# EAGLE design LTC2473CDR1 (EAGLE 9.6.2)
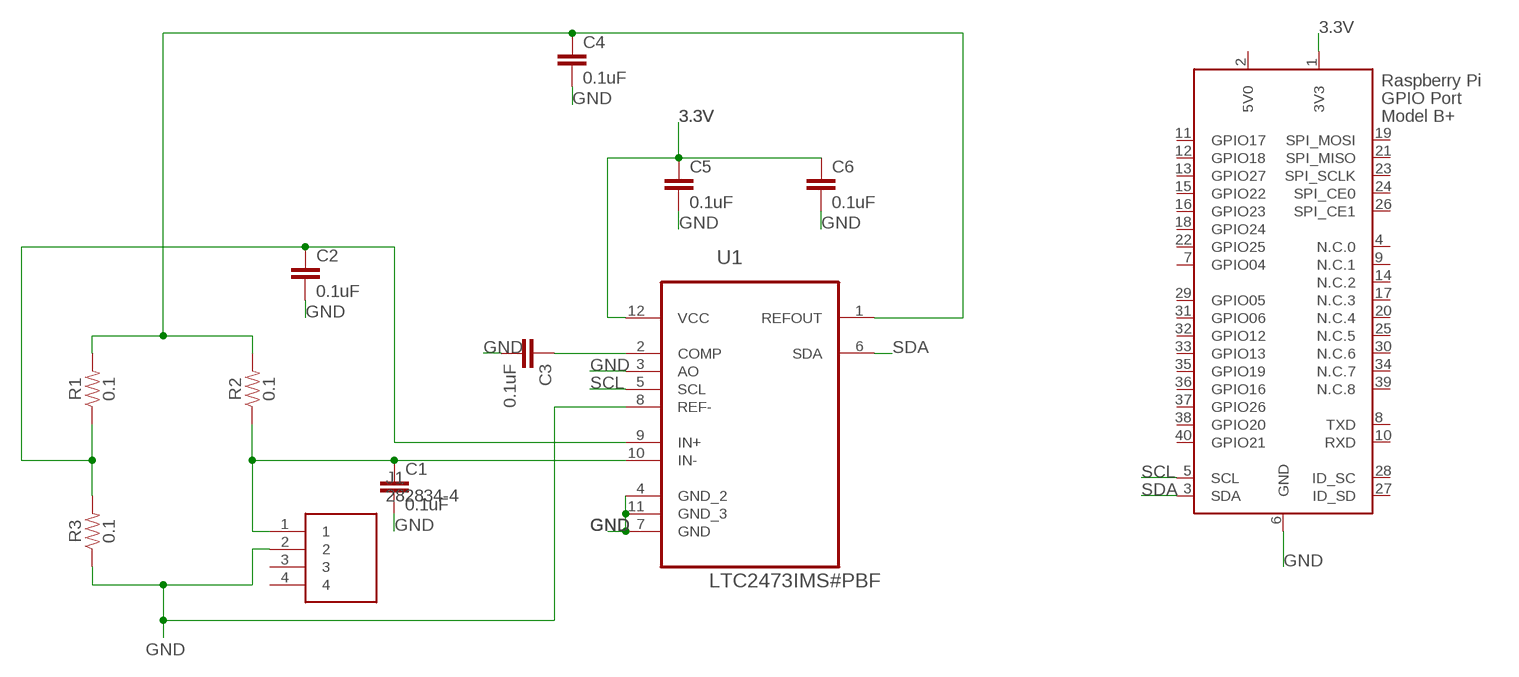
[diagram p0: schematic, sheet 1]

## Parts
C1  0.1uF  0.1UF-0603-25V-(+80/-20%)  [0603]
C2  0.1uF  0.1UF-0603-25V-(+80/-20%)  [0603]
C3  0.1uF  0.1UF-0603-25V-(+80/-20%)  [0603]
C4  0.1uF  0.1UF-0603-25V-(+80/-20%)  [0603]
C5  0.1uF  0.1UF-0603-25V-(+80/-20%)  [0603]
C6  0.1uF  0.1UF-0603-25V-(+80/-20%)  [0603]
J1  282834-4  [2828344]
R1  0.1  0.1OHM-0603-1/3W-1%  [0603]
R2  0.1  0.1OHM-0603-1/3W-1%  [0603]
R3  0.1  0.1OHM-0603-1/3W-1%  [0603]
U1  LTC2473IMS#PBF  [SOP65P490X110-12N]
X1  RASPI_BOARD_B+_HDC  [RASPI_BOARD_B+HAT_DF_CF]

## Nets
3.3V: C5.1 C6.1 U1.12(VCC) X1.1(3V3)
GND: C1.2 C2.2 C3.2 C4.2 C5.2 C6.2 J1.2 R3.1 U1.3(AO) U1.4(GND_2) U1.7(GND) U1.8(REF-) U1.11(GND_3) X1.6(GND)
N$1: C3.1 U1.2(COMP)
N$2: C2.1 R1.1 R3.2 U1.9(IN+)
N$4: C4.1 R1.2 R2.2 U1.1(REFOUT)
N$5: C1.1 J1.1 R2.1 U1.10(IN-)
SCL: U1.5(SCL) X1.5(SCL)
SDA: U1.6(SDA) X1.3(SDA)
Unconnected: J1.3 J1.4 X1.4(N.C.0) X1.7(GPIO04) X1.8(TXD) X1.9(N.C.1) X1.10(RXD) X1.11(GPIO17) X1.12(GPIO18) X1.13(GPIO27) X1.14(N.C.2) X1.15(GPIO22) X1.16(GPIO23) X1.17(N.C.3) X1.18(GPIO24) X1.19(SPI_MOSI) X1.20(N.C.4) X1.21(SPI_MISO) X1.22(GPIO25) X1.23(SPI_SCLK) X1.24(SPI_CE0) X1.25(N.C.5) X1.26(SPI_CE1) X1.27(ID_SD) X1.28(ID_SC) X1.29(GPIO05) X1.30(N.C.6) X1.31(GPIO06) X1.32(GPIO12) X1.33(GPIO13) X1.34(N.C.7) X1.35(GPIO19) X1.36(GPIO16) X1.37(GPIO26) X1.38(GPIO20) X1.39(N.C.8) X1.40(GPIO21)

## Power pins joined to a net without a drawn wire
5V0: X1.2(5V0)

## Library data of the parts
C1-C6 = SparkFun-Capacitors:0.1UF: 0.1µF ceramic capacitors A capacitor is a passive two-terminal electrical component used to store electrical energy temporarily in an electric field.; PROD_ID: CAP-00810
J1 = SamacSys_Parts:282834-4: ic Source: Datasheet <https://www.te.com/commerce/DocumentDelivery/DDEController?Action=srchrtrv&DocNm=282834&DocType=Customer Drawing&DocLang=English&PartCntxt=282834-4&DocFormat=pdf>; DESCRIPTION: ic; HEIGHT: 10.3mm; MANUFACTURER_NAME: TE Connectivity; MANUFACTURER_PART_NUMBER: 282834-4; MOUSER_PART_NUMBER: 571-282834-4; MOUSER_PRICE-STOCK: https://www.mouser.co.uk/ProductDetail/TE-Connectivity/282834-4?qs=A%252Bip%252BNCYi6Pqom9P%2FaHyRQ%3D%3D
R1-R3 = SparkFun-Resistors:0.1OHM: 0.1Ω resistor A resistor is a passive two-terminal electrical component that implements electrical resistance as a circuit element. Resistors act to reduce current flow, and, at the same time, act to lower voltage levels within circuits. - Wikipedia; PROD_ID: RES-15715
U1 = LTC2473IMS_PBF:LTC2473IMS#PBF: ADC Check availability <https://pricing.snapeda.com/parts/LTC2473IMS%23PBF/Analog%20Devices/view-part?ref=eda>; AVAILABILITY: In Stock; DESCRIPTION: Selectable 208sps/833sps, 16-Bit I2C ΔΣ ADCs with 10ppm/°C Max Precision Reference; MF: Analog Devices; MP: LTC2473IMS#PBF; PACKAGE: MSOP-12 Analog Devices; PRICE: None; PURCHASE-URL: https://pricing.snapeda.com/search/part/LTC2473IMS#PBF/?ref=eda
X1 = raspberrypi_bastelstube_v13:RASPI_BOARD_B+: Raspberry Pi GPIO connector with markings for the outer dimensions of the Raspberry Pi board model B+ with different sets of drill holes or mounting pads

## Board
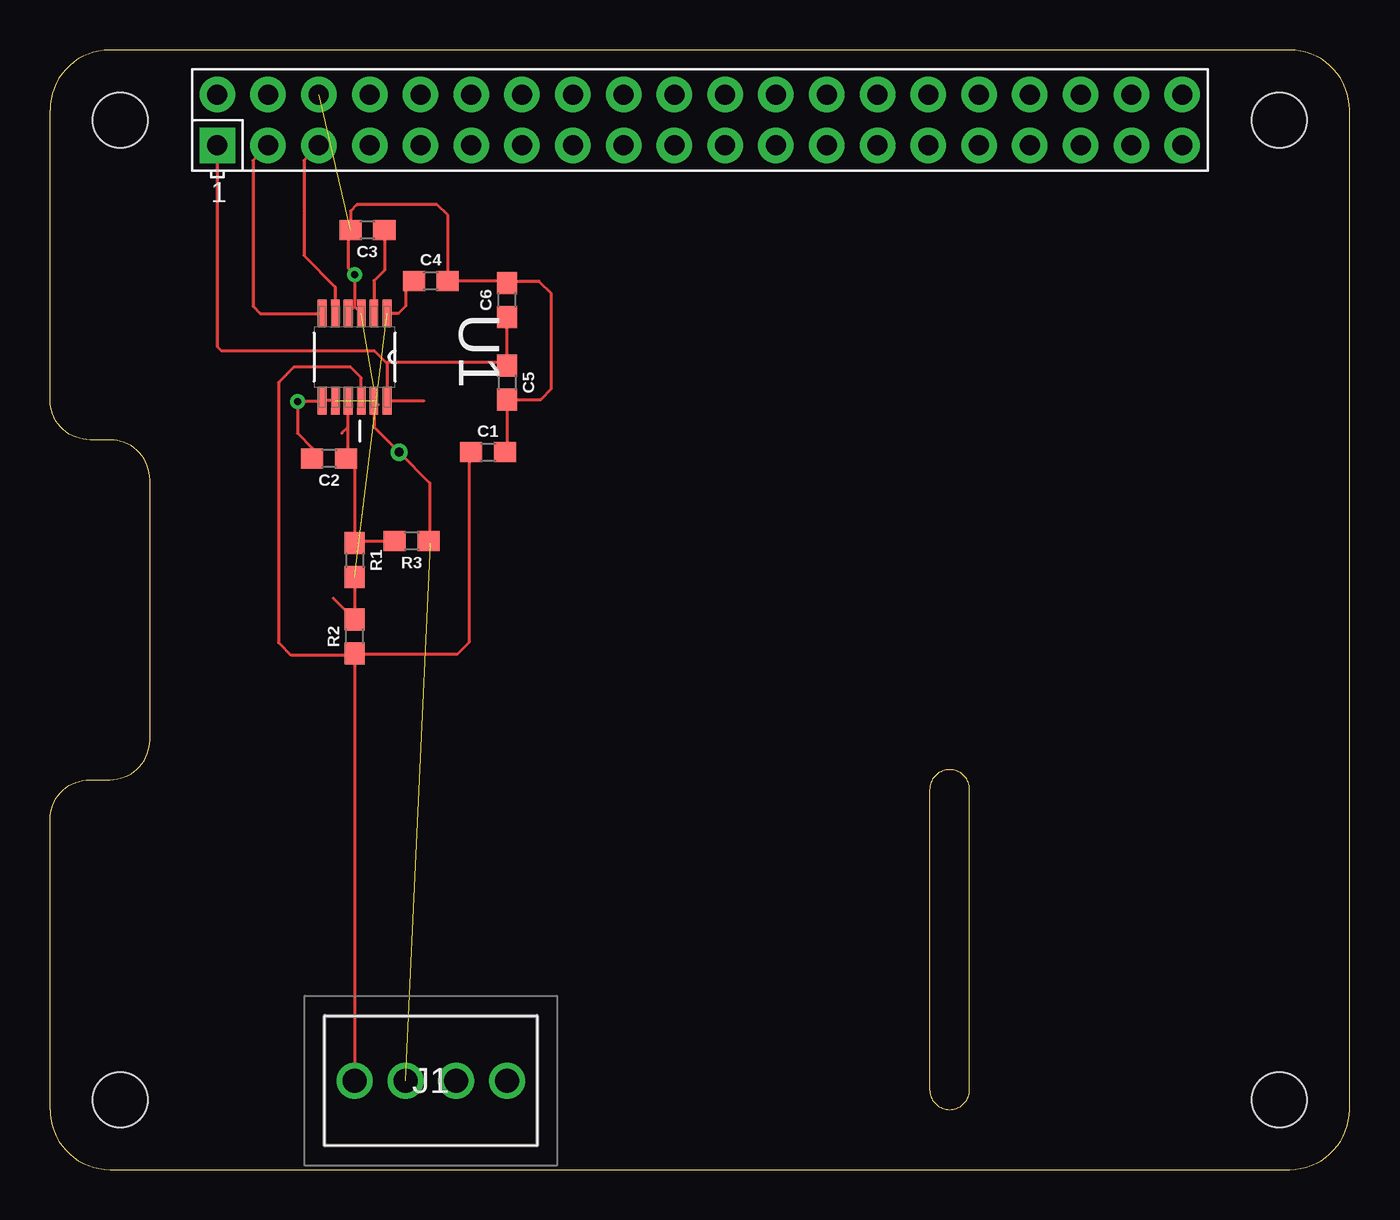
[diagram p1: board, top side]
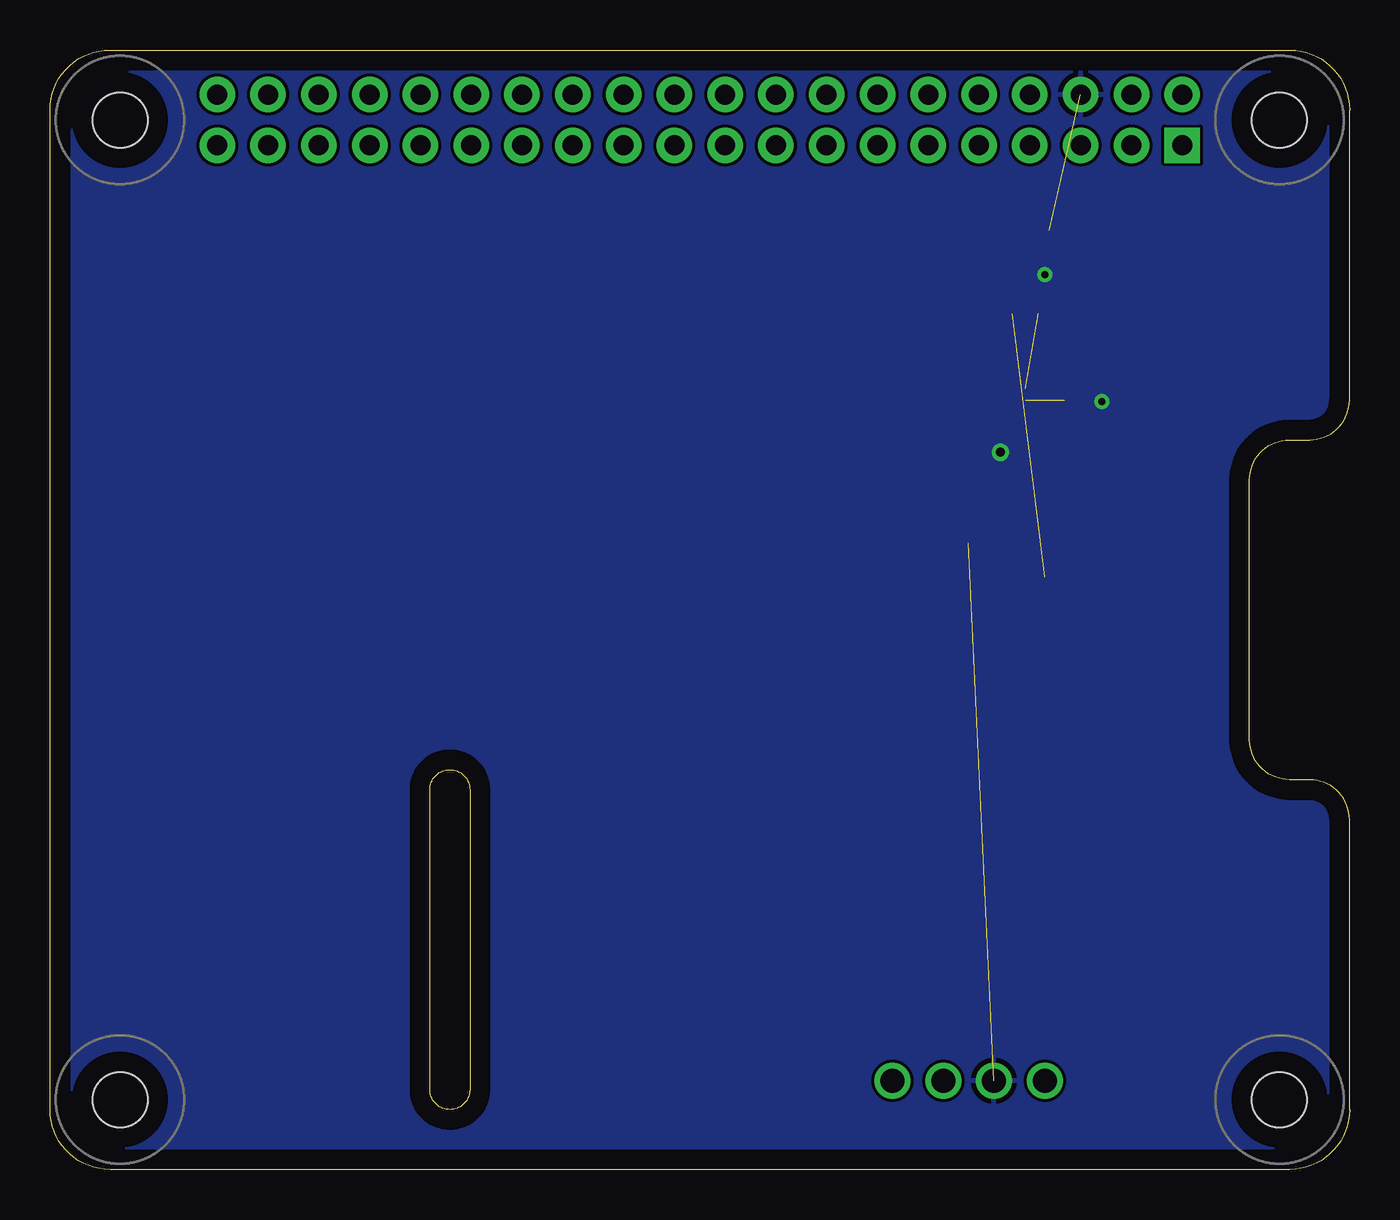
[diagram p2: board, bottom side, seen from below]

Size 65 x 56 mm. Coordinates in mm from the lower left corner, seen from the top.
Copper layers (1*16): Top 0.035mm / dielectric 1.5mm / Bottom 0.035mm
Design rules "default": minimum track width 6mil, minimum drill 0.35mm, track to track 6mil, track to pad 6mil, pad to pad 6mil, via to via 6mil, smd to smd 6mil, copper to edge 40mil, drill to drill 6mil, minimum pad ring 10mil, minimum via ring 8mil, stop-mask expansion 4mil, vias tented up to drill 0mil, thermal gap 10mil

### Footprints (pad centres in the part's own frame; a part is rotated, then mirrored left to right if it is on the bottom)
0603 = smd 1.1 x 1: 1 -0.85,0; 2 0.85,0
2828344 = drill 1.2 pad 1.8: 1 0,0; 2 2.54,0; 3 5.08,0; 4 7.62,0
SOP65P490X110-12N = smd 1.397 x 0.432: 1 -2.184,1.626; 2 -2.184,0.965; 3 -2.184,0.33; 4 -2.184,-0.33; 5 -2.184,-0.965; 6 -2.184,-1.626; 7 2.184,-1.626; 8 2.184,-0.965; 9 2.184,-0.33; 10 2.184,0.33; 11 2.184,0.965; 12 2.184,1.626
RASPI_BOARD_B+HAT_DF_CF = drill 1 pad 1.778 square: 1 8.37,51.23 | drill 1 pad 1.778: 2 8.37,53.77; 3 10.91,51.23; 4 10.91,53.77; 5 13.45,51.23; 6 13.45,53.77; 7 15.99,51.23; 8 15.99,53.77; 9 18.53,51.23; 10 18.53,53.77; 11 21.07,51.23; 12 21.07,53.77; 13 23.61,51.23; 14 23.61,53.77; 15 26.15,51.23; 16 26.15,53.77; 17 28.69,51.23; 18 28.69,53.77; 19 31.23,51.23; 20 31.23,53.77; 21 33.77,51.23; 22 33.77,53.77; 23 36.31,51.23; 24 36.31,53.77; 25 38.85,51.23; 26 38.85,53.77; 27 41.39,51.23; 28 41.39,53.77; 29 43.93,51.23; 30 43.93,53.77; 31 46.47,51.23; 32 46.47,53.77; 33 49.01,51.23; 34 49.01,53.77; 35 51.55,51.23; 36 51.55,53.77; 37 54.09,51.23; 38 54.09,53.77; 39 56.63,51.23; 40 56.63,53.77 | hole 2.75: 3.5,3.5; 3.5,52.5; 61.5,3.5; 61.5,52.5

### Placement (x,y rotation side)
C1  21.91,35.88 0 top
C2  13.97,35.56 180 top
C3  15.88,46.99 180 top
C4  19.05,44.45 0 top
C5  22.86,39.37 270 top
C6  22.86,43.5 90 top
J1  15.24,4.45 0 top
R1  15.24,30.48 270 top
R2  15.24,26.67 90 top
R3  18.1,31.43 180 top
U1  15.24,40.64 270 top
X1  0,0 0 top

### Tracks (layer width: path | path; a pad name or v marks a point on that pad's centre or on a via)
3.3V
  Top 0.152: X1.1 8.37,41.16 8.57,40.96 16.21,40.96 16.87,40.3 U1.12 | C6.1 C5.1 22.72,40.36 16.87,40.36 U1.12 | U1.12 18.69,38.46
GND  (via drill 0.35, 0.45)  (4 unrouted)
  Top 0.152: 15.24,43.16 U1.3 | 15.24,43.16 U1.4 | 15.24,43.16 v15.24,44.77 14.92,45.08 14.92,46.89 C3.2 15.02,47.94 15.34,48.26 19.37,48.26 19.9,47.73 C4.2 22.83,44.45 C6.2 22.96,44.45 24.45,44.45 25.08,43.81 25.08,39.05 24.55,38.52 C5.2 22.86,35.98 C1.2 23.18,35.46 | 16.2,39.06 U1.11 | U1.11 16.42,38.24 | U1.11 16.2,37.14 v17.46,35.88 19,34.34 19,31.38 | C2.2 13.12,36.09 12.38,36.83 v12.38,38.42 13.58,38.42 U1.7 U1.8 | 19.05,31.33 19,31.38 | R3.1 19,31.38
  pour Bottom: 0,55.88 64.77,55.88 64.77,0 0,0
N$1
  Top 0.152: C3.1 16.73,44.98 16.2,44.46 U1.2
N$2
  Top 0.152: 14.91,37.15 14.91,35.65 C2.1 15.24,35.14 R1.1 | 14.91,37.15 U1.9 | R1.1 15.34,31.43 R3.2 | 14.59,36.83 14.91,37.15 | 15.02,31.11 R1.1
N$4  (1 unrouted)
  Top 0.152: R1.2 R2.2 14.19,28.57 | C4.1 17.78,44.03 17.78,43.18 17.42,42.82 U1.1
N$5
  Top 0.152: C1.1 20.95,35.78 20.95,26.35 20.37,25.77 15.19,25.77 | U1.10 15.57,39.61 15.05,40.13 12.19,40.13 11.43,39.37 11.43,26.35 12.06,25.72 15.14,25.72 15.19,25.77 | 15.19,25.77 R2.1 J1.1
SCL
  Top 0.152: X1.5 12.7,50.48 12.7,47.94 12.7,45.72 14.27,44.14 U1.5
SDA
  Top 0.152: X1.3 10.16,50.48 10.16,43.18 10.52,42.82 U1.6